# Altium schematic sheet Sheet3.SchDoc: Memory ICs
size B; DocumentNumber: 3; SheetNumber: 3; SheetTotal: 5
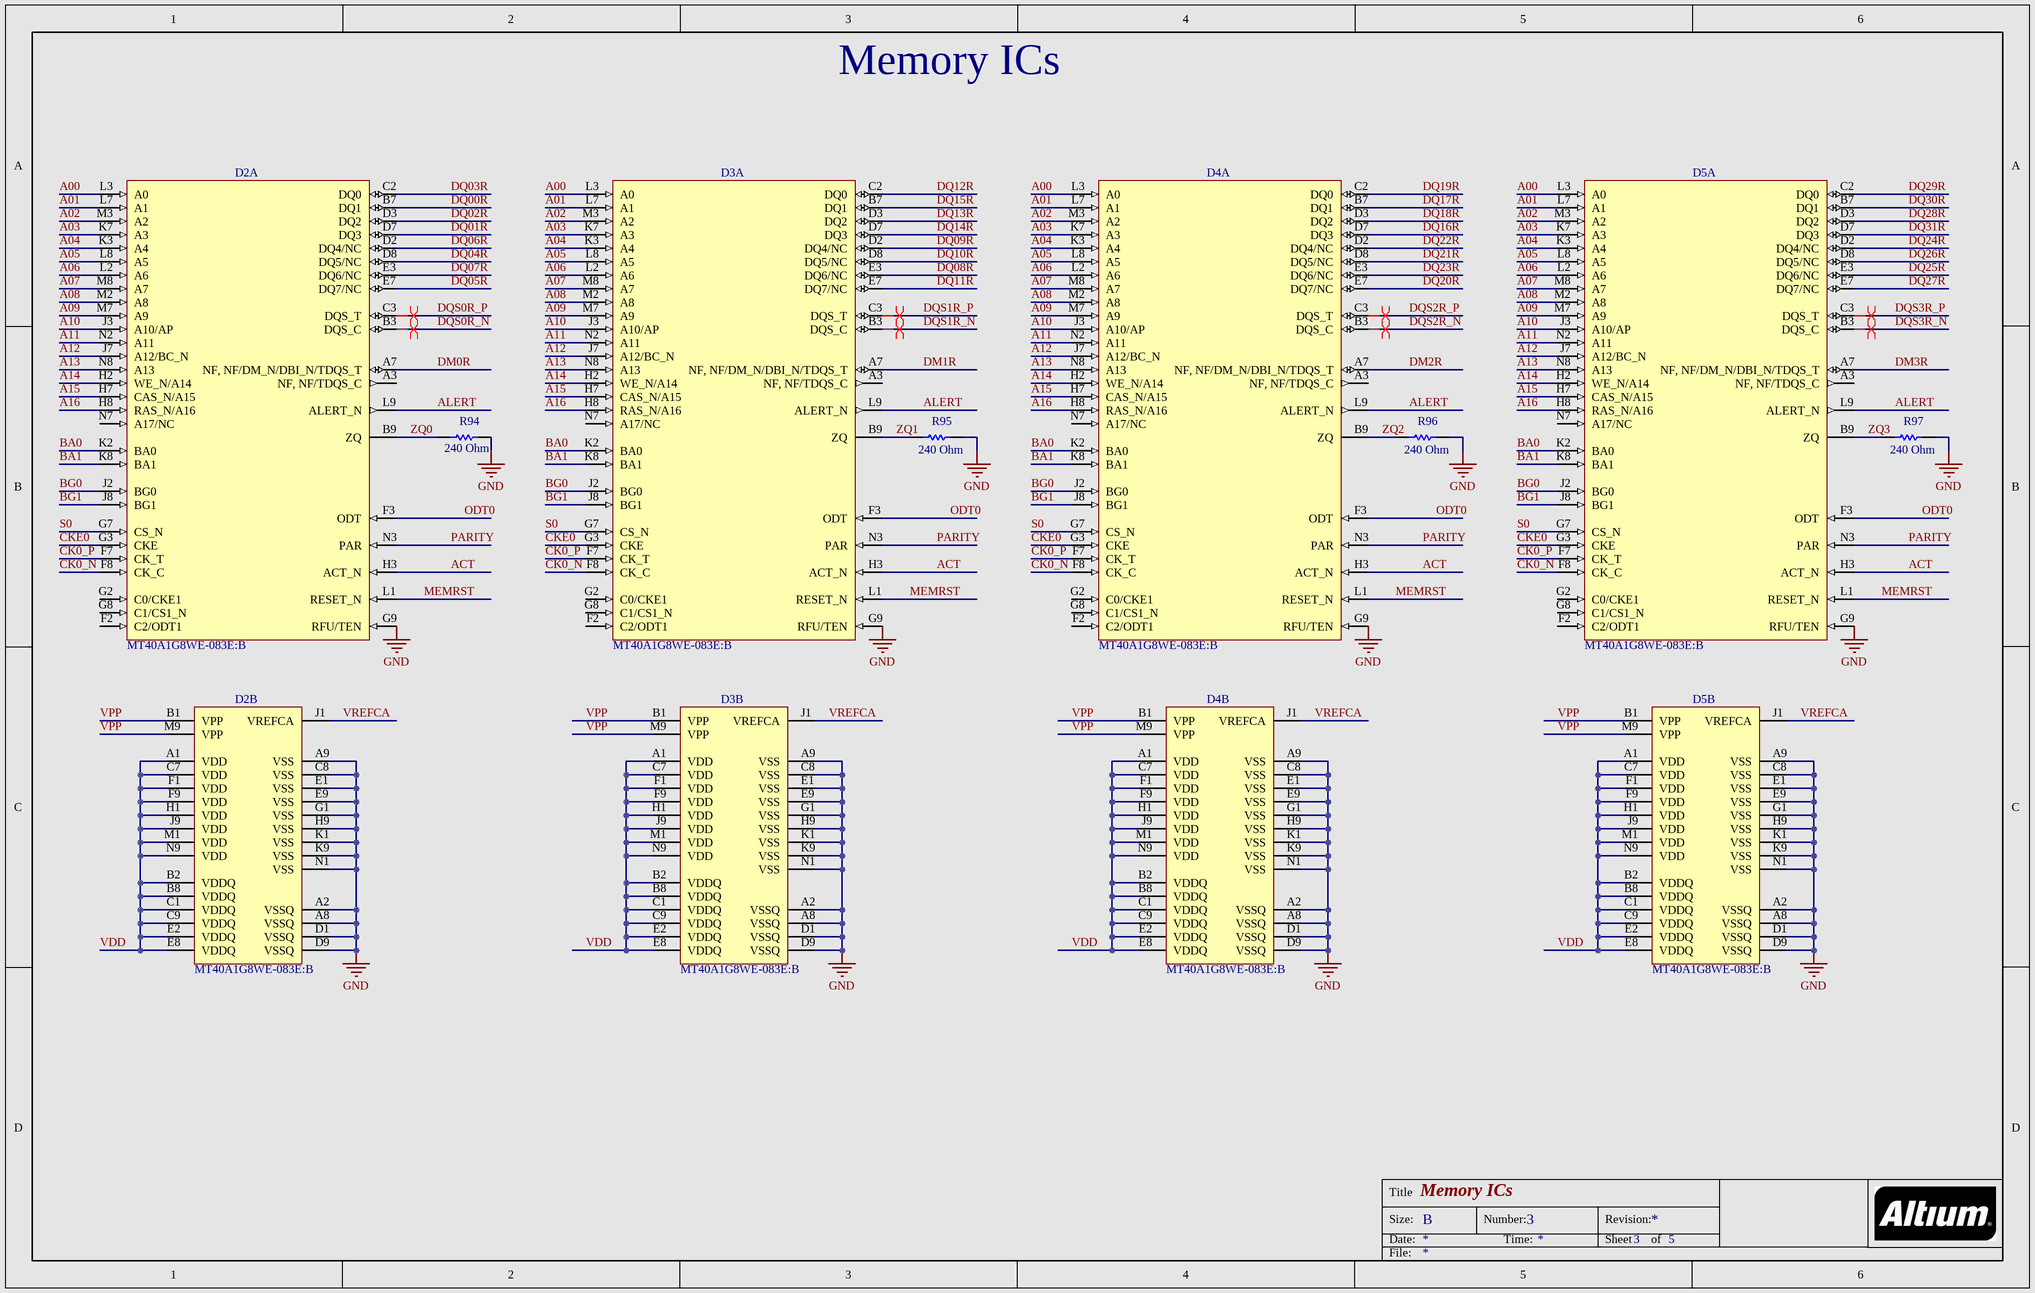
[diagram p0: Sheet3.SchDoc]

## Parts
D2  MT40A1G8WE-083E:B  [MICT-WE-78]  (parts A,B of 2)
D3  MT40A1G8WE-083E:B  [MICT-WE-78]  (parts A,B of 2)
D4  MT40A1G8WE-083E:B  [MICT-WE-78]  (parts A,B of 2)
D5  MT40A1G8WE-083E:B  [MICT-WE-78]  (parts A,B of 2)
R94  Resistance: 240 Ohm  [RESC1005X40X25ML05T05]  (hidden comment: ERJ-2GEJ241x)
R95  Resistance: 240 Ohm  [RESC1005X40X25ML05T05]  (hidden comment: ERJ-2GEJ241x)
R96  Resistance: 240 Ohm  [RESC1005X40X25ML05T05]  (hidden comment: ERJ-2GEJ241x)
R97  Resistance: 240 Ohm  [RESC1005X40X25ML05T05]  (hidden comment: ERJ-2GEJ241x)

## Nets
GND: D2.A2(VSSQ) D2.A8(VSSQ) D2.A9(VSS) D2.C8(VSS) D2.D1(VSSQ) D2.D9(VSSQ) D2.E1(VSS) D2.E9(VSS) D2.G1(VSS) D2.G9(RFU/TEN) D2.H9(VSS) D2.K1(VSS) D2.K9(VSS) D2.N1(VSS) D3.A2(VSSQ) D3.A8(VSSQ) D3.A9(VSS) D3.C8(VSS) D3.D1(VSSQ) D3.D9(VSSQ) D3.E1(VSS) D3.E9(VSS) D3.G1(VSS) D3.G9(RFU/TEN) D3.H9(VSS) D3.K1(VSS) D3.K9(VSS) D3.N1(VSS) D4.A2(VSSQ) D4.A8(VSSQ) D4.A9(VSS) D4.C8(VSS) D4.D1(VSSQ) D4.D9(VSSQ) D4.E1(VSS) D4.E9(VSS) D4.G1(VSS) D4.G9(RFU/TEN) D4.H9(VSS) D4.K1(VSS) D4.K9(VSS) D4.N1(VSS) D5.A2(VSSQ) D5.A8(VSSQ) D5.A9(VSS) D5.C8(VSS) D5.D1(VSSQ) D5.D9(VSSQ) D5.E1(VSS) D5.E9(VSS) D5.G1(VSS) D5.G9(RFU/TEN) D5.H9(VSS) D5.K1(VSS) D5.K9(VSS) D5.N1(VSS) R94.1 R95.1 R96.1 R97.1
A00: D2.L3(A0) D3.L3(A0) D4.L3(A0) D5.L3(A0)
A01: D2.L7(A1) D3.L7(A1) D4.L7(A1) D5.L7(A1)
A02: D2.M3(A2) D3.M3(A2) D4.M3(A2) D5.M3(A2)
A03: D2.K7(A3) D3.K7(A3) D4.K7(A3) D5.K7(A3)
A04: D2.K3(A4) D3.K3(A4) D4.K3(A4) D5.K3(A4)
A05: D2.L8(A5) D3.L8(A5) D4.L8(A5) D5.L8(A5)
A06: D2.L2(A6) D3.L2(A6) D4.L2(A6) D5.L2(A6)
A07: D2.M8(A7) D3.M8(A7) D4.M8(A7) D5.M8(A7)
A08: D2.M2(A8) D3.M2(A8) D4.M2(A8) D5.M2(A8)
A09: D2.M7(A9) D3.M7(A9) D4.M7(A9) D5.M7(A9)
A10: D2.J3(A10/AP) D3.J3(A10/AP) D4.J3(A10/AP) D5.J3(A10/AP)
A11: D2.N2(A11) D3.N2(A11) D4.N2(A11) D5.N2(A11)
A12: D2.J7(A12/BC_N) D3.J7(A12/BC_N) D4.J7(A12/BC_N) D5.J7(A12/BC_N)
A13: D2.N8(A13) D3.N8(A13) D4.N8(A13) D5.N8(A13)
A14: D2.H2(WE_N/A14) D3.H2(WE_N/A14) D4.H2(WE_N/A14) D5.H2(WE_N/A14)
A15: D2.H7(CAS_N/A15) D3.H7(CAS_N/A15) D4.H7(CAS_N/A15) D5.H7(CAS_N/A15)
A16: D2.H8(RAS_N/A16) D3.H8(RAS_N/A16) D4.H8(RAS_N/A16) D5.H8(RAS_N/A16)
ACT: D2.H3(ACT_N) D3.H3(ACT_N) D4.H3(ACT_N) D5.H3(ACT_N)
ALERT: D2.L9(ALERT_N) D3.L9(ALERT_N) D4.L9(ALERT_N) D5.L9(ALERT_N)
BA0: D2.K2(BA0) D3.K2(BA0) D4.K2(BA0) D5.K2(BA0)
BA1: D2.K8(BA1) D3.K8(BA1) D4.K8(BA1) D5.K8(BA1)
BG0: D2.J2(BG0) D3.J2(BG0) D4.J2(BG0) D5.J2(BG0)
BG1: D2.J8(BG1) D3.J8(BG1) D4.J8(BG1) D5.J8(BG1)
CK0_N: D2.F8(CK_C) D3.F8(CK_C) D4.F8(CK_C) D5.F8(CK_C)
CK0_P: D2.F7(CK_T) D3.F7(CK_T) D4.F7(CK_T) D5.F7(CK_T)
CKE0: D2.G3(CKE) D3.G3(CKE) D4.G3(CKE) D5.G3(CKE)
DM0R: D2.A7(NF,_NF/DM_N/DBI_N/TDQS_T)
DM1R: D3.A7(NF,_NF/DM_N/DBI_N/TDQS_T)
DM2R: D4.A7(NF,_NF/DM_N/DBI_N/TDQS_T)
DM3R: D5.A7(NF,_NF/DM_N/DBI_N/TDQS_T)
DQ00R: D2.B7(DQ1)
DQ01R: D2.D7(DQ3)
DQ02R: D2.D3(DQ2)
DQ03R: D2.C2(DQ0)
DQ04R: D2.D8(DQ5/NC)
DQ05R: D2.E7(DQ7/NC)
DQ06R: D2.D2(DQ4/NC)
DQ07R: D2.E3(DQ6/NC)
DQ08R: D3.E3(DQ6/NC)
DQ09R: D3.D2(DQ4/NC)
DQ10R: D3.D8(DQ5/NC)
DQ11R: D3.E7(DQ7/NC)
DQ12R: D3.C2(DQ0)
DQ13R: D3.D3(DQ2)
DQ14R: D3.D7(DQ3)
DQ15R: D3.B7(DQ1)
DQ16R: D4.D7(DQ3)
DQ17R: D4.B7(DQ1)
DQ18R: D4.D3(DQ2)
DQ19R: D4.C2(DQ0)
DQ20R: D4.E7(DQ7/NC)
DQ21R: D4.D8(DQ5/NC)
DQ22R: D4.D2(DQ4/NC)
DQ23R: D4.E3(DQ6/NC)
DQ24R: D5.D2(DQ4/NC)
DQ25R: D5.E3(DQ6/NC)
DQ26R: D5.D8(DQ5/NC)
DQ27R: D5.E7(DQ7/NC)
DQ28R: D5.D3(DQ2)
DQ29R: D5.C2(DQ0)
DQ30R: D5.B7(DQ1)
DQ31R: D5.D7(DQ3)
DQS0R_N: D2.B3(DQS_C)
DQS0R_P: D2.C3(DQS_T)
DQS1R_N: D3.B3(DQS_C)
DQS1R_P: D3.C3(DQS_T)
DQS2R_N: D4.B3(DQS_C)
DQS2R_P: D4.C3(DQS_T)
DQS3R_N: D5.B3(DQS_C)
DQS3R_P: D5.C3(DQS_T)
MEMRST: D2.L1(RESET_N) D3.L1(RESET_N) D4.L1(RESET_N) D5.L1(RESET_N)
ODT0: D2.F3(ODT) D3.F3(ODT) D4.F3(ODT) D5.F3(ODT)
PARITY: D2.N3(PAR) D3.N3(PAR) D4.N3(PAR) D5.N3(PAR)
S0: D2.G7(CS_N) D3.G7(CS_N) D4.G7(CS_N) D5.G7(CS_N)
VDD: D2.A1(VDD) D2.B2(VDDQ) D2.B8(VDDQ) D2.C1(VDDQ) D2.C7(VDD) D2.C9(VDDQ) D2.E2(VDDQ) D2.E8(VDDQ) D2.F1(VDD) D2.F9(VDD) D2.H1(VDD) D2.J9(VDD) D2.M1(VDD) D2.N9(VDD) D3.A1(VDD) D3.B2(VDDQ) D3.B8(VDDQ) D3.C1(VDDQ) D3.C7(VDD) D3.C9(VDDQ) D3.E2(VDDQ) D3.E8(VDDQ) D3.F1(VDD) D3.F9(VDD) D3.H1(VDD) D3.J9(VDD) D3.M1(VDD) D3.N9(VDD) D4.A1(VDD) D4.B2(VDDQ) D4.B8(VDDQ) D4.C1(VDDQ) D4.C7(VDD) D4.C9(VDDQ) D4.E2(VDDQ) D4.E8(VDDQ) D4.F1(VDD) D4.F9(VDD) D4.H1(VDD) D4.J9(VDD) D4.M1(VDD) D4.N9(VDD) D5.A1(VDD) D5.B2(VDDQ) D5.B8(VDDQ) D5.C1(VDDQ) D5.C7(VDD) D5.C9(VDDQ) D5.E2(VDDQ) D5.E8(VDDQ) D5.F1(VDD) D5.F9(VDD) D5.H1(VDD) D5.J9(VDD) D5.M1(VDD) D5.N9(VDD)
VPP: D2.B1(VPP) D2.M9(VPP) D3.B1(VPP) D3.M9(VPP) D4.B1(VPP) D4.M9(VPP) D5.B1(VPP) D5.M9(VPP)
VREFCA: D2.J1(VREFCA) D3.J1(VREFCA) D4.J1(VREFCA) D5.J1(VREFCA)
ZQ0: D2.B9(ZQ) R94.2
ZQ1: D3.B9(ZQ) R95.2
ZQ2: D4.B9(ZQ) R96.2
ZQ3: D5.B9(ZQ) R97.2

Not connected (* = marked no-connect by the designer): D2 A3(NF,_NF/TDQS_C) F2(C2/ODT1) G2(C0/CKE1) G8(C1/CS1_N) N7(A17/NC); D3 A3(NF,_NF/TDQS_C) F2(C2/ODT1) G2(C0/CKE1) G8(C1/CS1_N) N7(A17/NC); D4 A3(NF,_NF/TDQS_C) F2(C2/ODT1) G2(C0/CKE1) G8(C1/CS1_N) N7(A17/NC); D5 A3(NF,_NF/TDQS_C) F2(C2/ODT1) G2(C0/CKE1) G8(C1/CS1_N) N7(A17/NC)

## Layout directives
differential pair: DQS0R_N, DQS0R_P, DQS1R_N, DQS1R_P, DQS2R_N, DQS2R_P, DQS3R_N, DQS3R_P

## Notes on the sheet
- Title
- Size:
- Date:
- B
- Number:
- Time:
- Revision:
- Sheet
- of
- File:

## Library data of the parts
D2-D5 = CMP-1738-00001-1: 8 Gb DDR4 SDRAM, 1 Gig x 8, 1.2 V, 0 to 95 degC, 78-Ball FBGA (WE), RoHS; DatasheetVersion: Rev. E, 05/2016; ComponentLink2Description: Datasheet; ComponentLink2URL: https://www.micron.com/~/media/documents/products/data-sheet/dram/ddr4/8gb_ddr4_sdram.pdf; PartNumber: MT40A1G8WE-083E:B; PackageDescription: 78-Ball Ball Grid Array, Body 8 x 12 mm, Pitch 0.8 mm; ComponentLink1URL: http://www.micron.com/; ComponentLink1Description: Manufacturer URL; Mounting Technology: Surface Mount; PartId: 1
R94-R97 = CMP-2002-00493-3: Chip Resistor, 240 Ohm, +/- 5%, 100 mW, -55 to 155 degC, 0402 (1005 Metric), RoHS, Tape and Reel; Manufacturer: Basic Passives; Voltage Rating: 50 V; Case\/Package: 0402; Power Rating: 100 mW; PackageReference: 0402; ComponentLink1URL: http://www.panasonic.com/; ComponentLink2Description: Datasheet; PackageDescription: 2-Pin Surface Mount Device, Body 1 x 0.5 mm; Tolerance: 5%; Radiation Hardening: No; Packaging: Tape and Reel; Case Code (Metric): 1005; PartNumber: ERJ-2GEJ241x; Case Code (Imperial): 0402; Mount: Surface Mount; REACH SVHC: Yes; Length: 1 mm; Mounting Technology: Surface Mount; Max Operating Temperature: 155 degC; Height: 0.35 mm; Width: 0.5 mm; Package Quantity: 10000; RoHSCompliant: true; DatasheetVersion: 03/2015; Pins: 2; ComponentLink1Description: Manufacturer URL; Min Operating Temperature: -55 degC; ComponentLink2URL: http://industrial.panasonic.com/cdbs/www-data/pdf/RDA0000/AOA0000C84.pdf